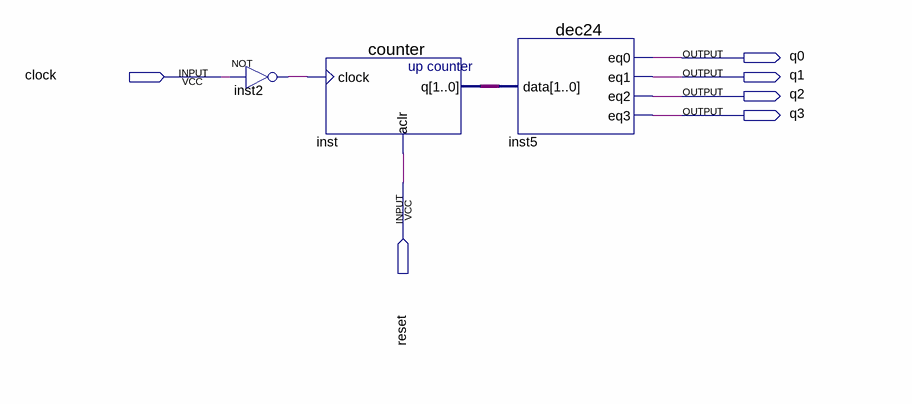
[diagram p0: schematic sheet]
// Quartus schematic sequencer4.bdf as structural Verilog: 3 symbols, 6 pins
module sequencer4 (
  input  clock,
  input  reset,
  output q0,
  output q1,
  output q2,
  output q3
);

  wire inst2_out;
  wire [1:0] inst_q;

  not inst2 (inst2_out, clock);
  counter inst (.clock(inst2_out), .aclr(reset), .q(inst_q));
  dec24 inst5 (.data(inst_q), .eq0(q0), .eq1(q1), .eq2(q2), .eq3(q3));
endmodule
